# EAGLE schematic v2.0 - Calibração (EAGLE 9.6.2)
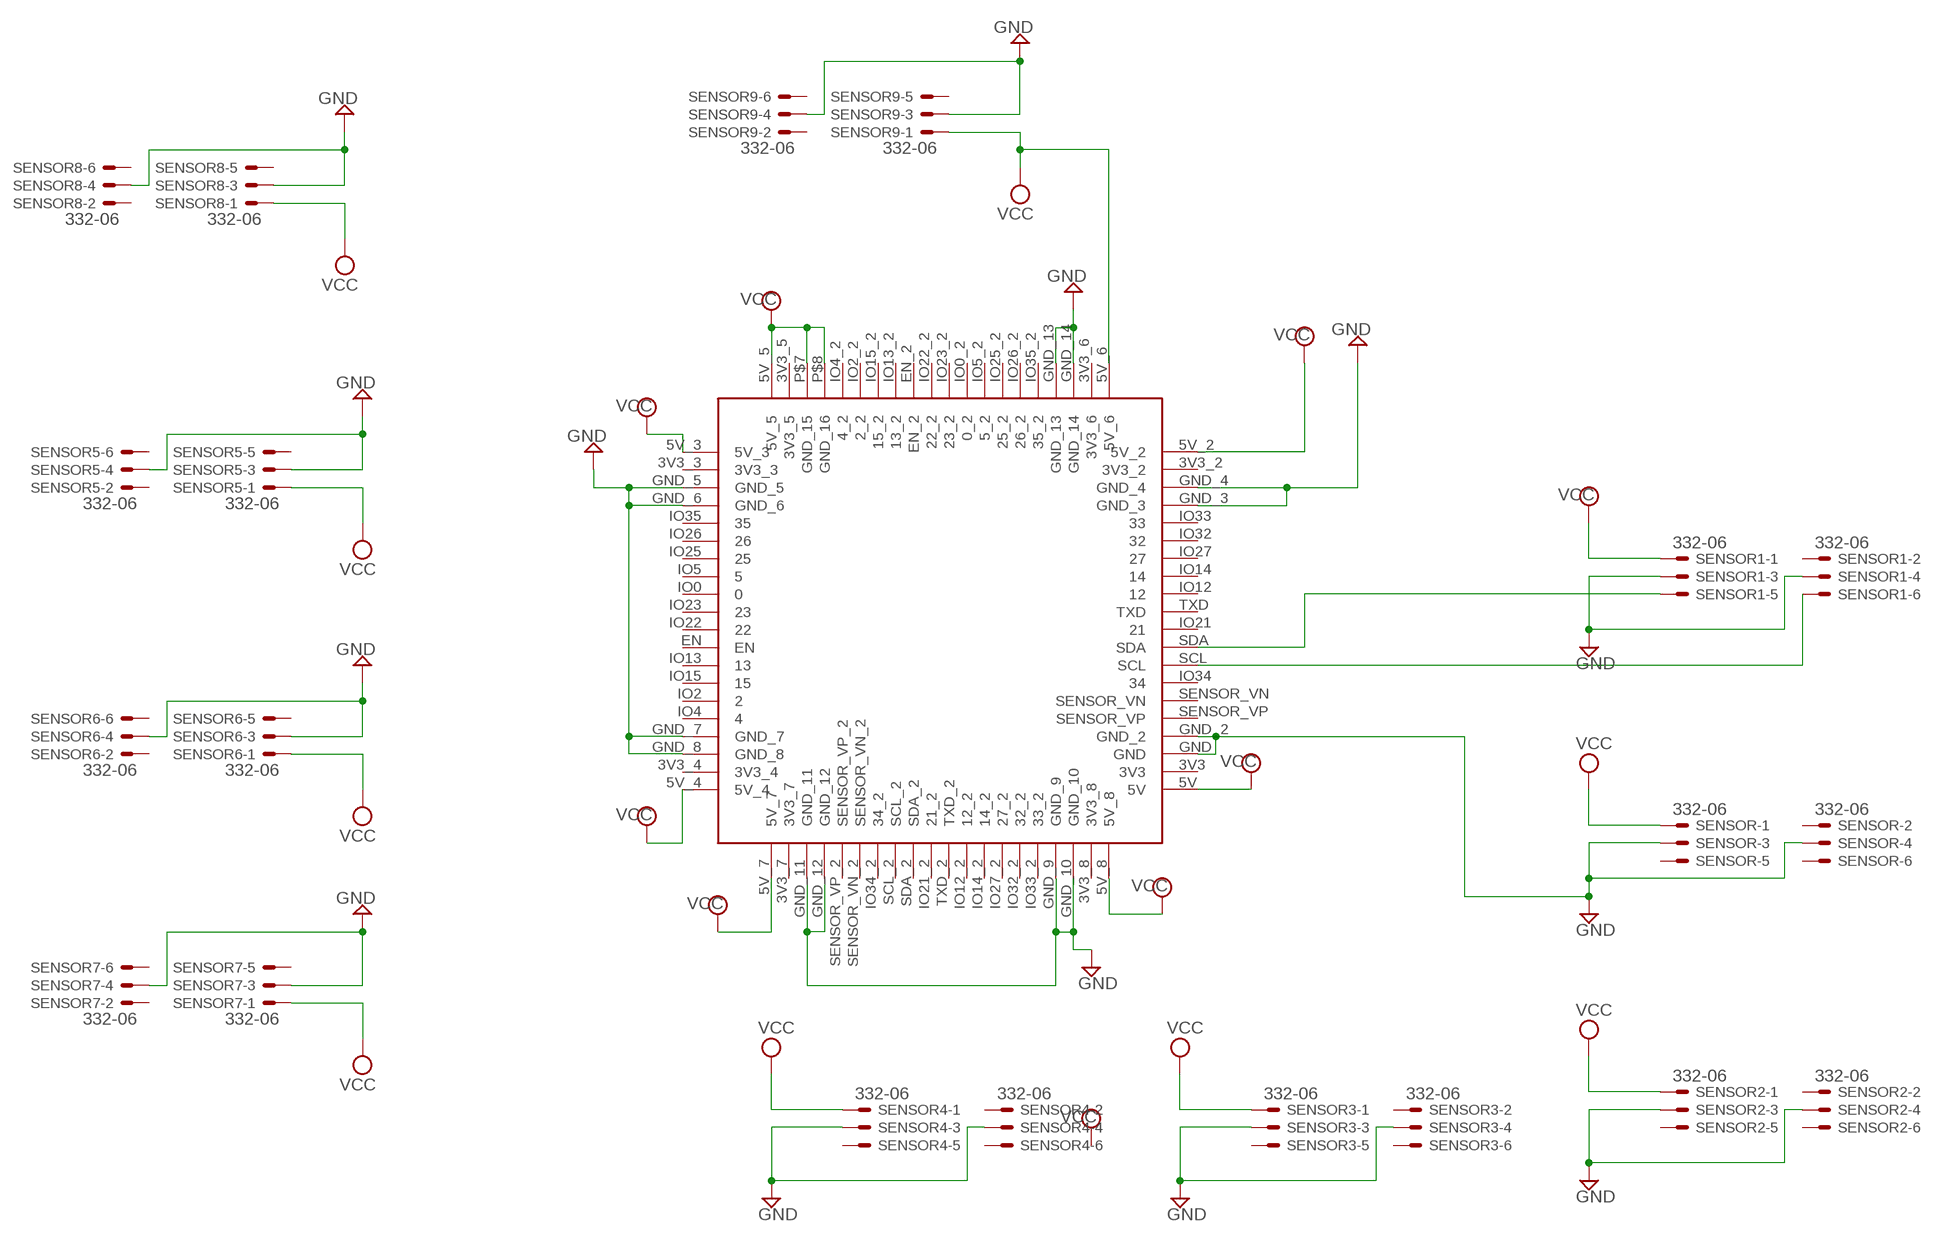
[diagram p0: schematic, sheet 1]

## Parts
SENSOR  332-06  [332-06]
SENSOR1  332-06  [332-06]
SENSOR2  332-06  [332-06]
SENSOR3  332-06  [332-06]
SENSOR4  332-06  [332-06]
SENSOR5  332-06  [332-06]
SENSOR6  332-06  [332-06]
SENSOR7  332-06  [332-06]
SENSOR8  332-06  [332-06]
SENSOR9  332-06  [332-06]
U$1  WT32_SC01  [WT32]

## Nets
GND: SENSOR1.3 SENSOR1.4 SENSOR2.3 SENSOR2.4 SENSOR3.3 SENSOR3.4 SENSOR4.3 SENSOR4.4 SENSOR5.3 SENSOR5.4 SENSOR6.3 SENSOR6.4 SENSOR7.3 SENSOR7.4 SENSOR8.3 SENSOR8.4 SENSOR9.3 SENSOR9.4 SENSOR.3 SENSOR.4 U$1.GND U$1.GND_2 U$1.GND_3 U$1.GND_4 U$1.GND_5 U$1.GND_6 U$1.GND_7 U$1.GND_8 U$1.GND_9 U$1.GND_10 U$1.GND_11 U$1.GND_12 U$1.GND_13 U$1.GND_14
N$1: SENSOR1.5 U$1.SDA
N$2: SENSOR1.6 U$1.SCL
VCC: SENSOR1.1 SENSOR2.1 SENSOR3.1 SENSOR4.1 SENSOR5.1 SENSOR6.1 SENSOR7.1 SENSOR8.1 SENSOR9.1 SENSOR.1 U$1.5V U$1.5V_2 U$1.5V_3 U$1.5V_4 U$1.5V_5 U$1.5V_6 U$1.5V_7 U$1.5V_8 U$1.P$7(GND_15) U$1.P$8(GND_16)
Unconnected: SENSOR1.2 SENSOR2.2 SENSOR2.5 SENSOR2.6 SENSOR3.2 SENSOR3.5 SENSOR3.6 SENSOR4.2 SENSOR4.5 SENSOR4.6 SENSOR5.2 SENSOR5.5 SENSOR5.6 SENSOR6.2 SENSOR6.5 SENSOR6.6 SENSOR7.2 SENSOR7.5 SENSOR7.6 SENSOR8.2 SENSOR8.5 SENSOR8.6 SENSOR9.2 SENSOR9.5 SENSOR9.6 SENSOR.2 SENSOR.5 SENSOR.6 U$1.3V3 U$1.3V3_2 U$1.3V3_3 U$1.3V3_4 U$1.3V3_5 U$1.3V3_6 U$1.3V3_7 U$1.3V3_8 U$1.EN U$1.EN_2 U$1.IO0 U$1.IO0_2(0_2) U$1.IO2 U$1.IO2_2(2_2) U$1.IO4 U$1.IO4_2(4_2) U$1.IO5 U$1.IO5_2(5_2) U$1.IO12 U$1.IO12_2(12_2) U$1.IO13 U$1.IO13_2(13_2) U$1.IO14 U$1.IO14_2(14_2) U$1.IO15 U$1.IO15_2(15_2) U$1.IO21 U$1.IO21_2(21_2) U$1.IO22 U$1.IO22_2(22_2) U$1.IO23 U$1.IO23_2(23_2) U$1.IO25 U$1.IO25_2(25_2) U$1.IO26 U$1.IO26_2(26_2) U$1.IO27 U$1.IO27_2(27_2) U$1.IO32 U$1.IO32_2(32_2) U$1.IO33 U$1.IO33_2(33_2) U$1.IO34 U$1.IO34_2(34_2) U$1.IO35 U$1.IO35_2(35_2) U$1.SCL_2 U$1.SDA_2 U$1.SENSOR_VN U$1.SENSOR_VN_2 U$1.SENSOR_VP U$1.SENSOR_VP_2 U$1.TXD U$1.TXD_2

## Library data of the parts
SENSOR SENSOR1-SENSOR9 = con-garry:332-06: 6 Pin - 2mm Dual Row Source: www.mpe-connector.de / garry_shortform_2012.pdf
U$1 = WT32_SC01:WT32_SC01